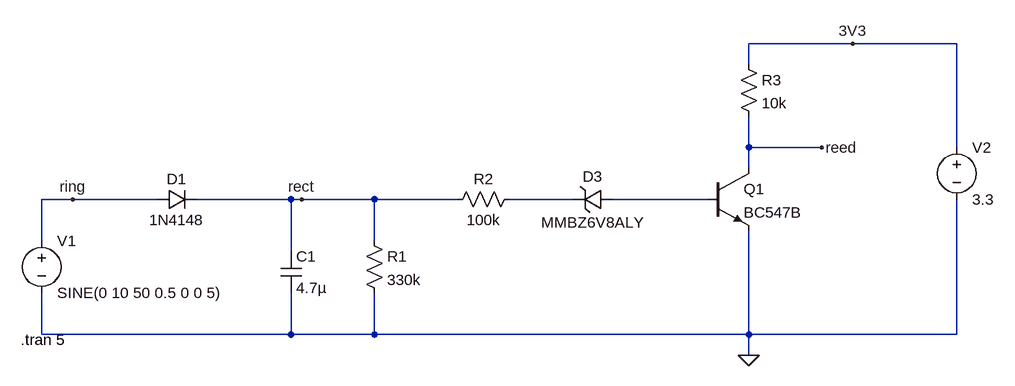
[diagram p0: schematic V2_simple_zener.asc]
V2_simple_zener.asc, the LTspice schematic file:
Version 4
SHEET 1 1520 680
WIRE 1296 -160 1136 -160
WIRE 1456 -160 1296 -160
WIRE 1136 -128 1136 -160
WIRE 1136 0 1136 -48
WIRE 1248 0 1136 0
WIRE 1456 0 1456 -160
WIRE 1136 32 1136 0
WIRE 96 80 48 80
WIRE 224 80 96 80
WIRE 432 80 288 80
WIRE 448 80 432 80
WIRE 560 80 448 80
WIRE 688 80 560 80
WIRE 864 80 768 80
WIRE 1072 80 928 80
WIRE 48 144 48 80
WIRE 560 144 560 80
WIRE 432 160 432 80
WIRE 48 288 48 224
WIRE 432 288 432 224
WIRE 432 288 48 288
WIRE 560 288 560 224
WIRE 560 288 432 288
WIRE 1136 288 1136 128
WIRE 1136 288 560 288
WIRE 1456 288 1456 80
WIRE 1456 288 1136 288
WIRE 1136 320 1136 288
FLAG 96 80 ring
FLAG 1136 320 0
FLAG 448 80 rect
FLAG 1296 -160 3V3
FLAG 1248 0 reed
SYMBOL voltage 48 128 R0
WINDOW 123 0 0 Left 0
WINDOW 39 0 0 Left 0
SYMATTR InstName V1
SYMATTR Value SINE(0 10 50 0.5 0 0 5)
SYMBOL res 544 128 R0
SYMATTR InstName R1
SYMATTR Value 330k
SYMBOL diode 224 96 R270
WINDOW 0 32 32 VTop 2
WINDOW 3 0 32 VBottom 2
SYMATTR InstName D1
SYMATTR Value 1N4148
SYMBOL cap 416 160 R0
SYMATTR InstName C1
SYMATTR Value 4.7µ
SYMBOL res 784 64 R90
WINDOW 0 0 56 VBottom 2
WINDOW 3 32 56 VTop 2
SYMATTR InstName R2
SYMATTR Value 100k
SYMBOL npn 1072 32 R0
SYMATTR InstName Q1
SYMATTR Value BC547B
SYMBOL res 1120 -144 R0
SYMATTR InstName R3
SYMATTR Value 10k
SYMBOL voltage 1456 -16 R0
WINDOW 123 0 0 Left 0
WINDOW 39 0 0 Left 0
SYMATTR InstName V2
SYMATTR Value 3.3
SYMBOL zener 928 64 R90
WINDOW 0 -4 32 VBottom 2
WINDOW 3 36 32 VTop 2
SYMATTR InstName D3
SYMATTR Value MMBZ6V8ALY
TEXT 16 296 Left 2 !.tran 5

The netlist it stands for:
* V2_simple_zener.asc
V1 ring 0 SINE(0 10 50 0.5 0 0 5)
R1 rect 0 330k
D1 ring rect 1N4148
C1 rect 0 4.7µ
R2 N001 rect 100k
Q1 reed N002 0 0 BC547B
R3 3V3 reed 10k
V2 3V3 0 3.3
D3 N002 N001 MMBZ6V8ALY
.model D D
.lib standard.dio
.model NPN NPN
.model PNP PNP
.lib standard.bjt
.tran 5
.backanno
.end